# EAGLE design sx3_breakout (EAGLE 9.5.2)
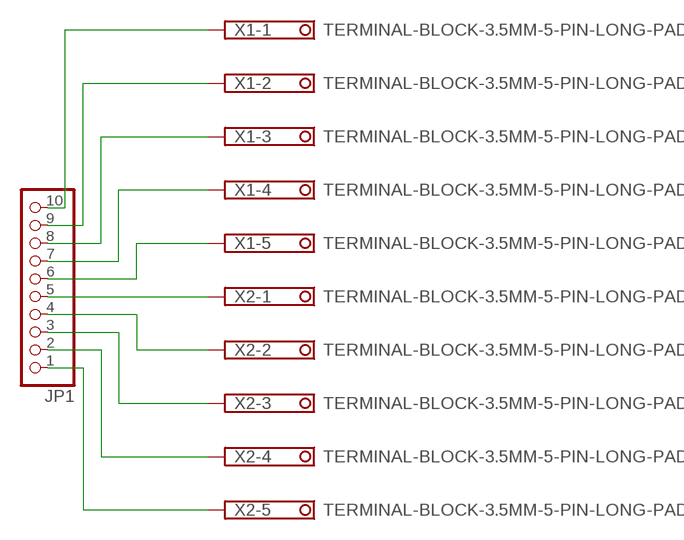
[diagram p0: schematic, sheet 1]

## Parts
JP1  PINHD-1X10  [1X10]
X1  TERMINAL-BLOCK-3.5MM-5-PIN-LONG-PAD  [TERMINAL-BLOCK-5-PIN-3.5MM-LONG-PAD]
X2  TERMINAL-BLOCK-3.5MM-5-PIN-LONG-PAD  [TERMINAL-BLOCK-5-PIN-3.5MM-LONG-PAD]

## Nets
N$1: JP1.10 X1.1
N$2: JP1.9 X1.2
N$3: JP1.8 X1.3
N$4: JP1.7 X1.4
N$5: JP1.6 X1.5
N$6: JP1.5 X2.1
N$7: JP1.4 X2.2
N$8: JP1.3 X2.3
N$9: JP1.2 X2.4
N$10: JP1.1 X2.5

## Library data of the parts
JP1 = pinhead:PINHD-1X10: PIN HEADER
X1 X2 = Rembrandt Electronics - Terminal Block 3-5mm v1-0:TERMINAL-BLOCK-3.5MM-5-PIN: Terminal Block 3.5mm Pitch: 3,5 mm Number of pins: 5 Created by Rembrandt Electronics www.rembrandtelectronics.com

## Board
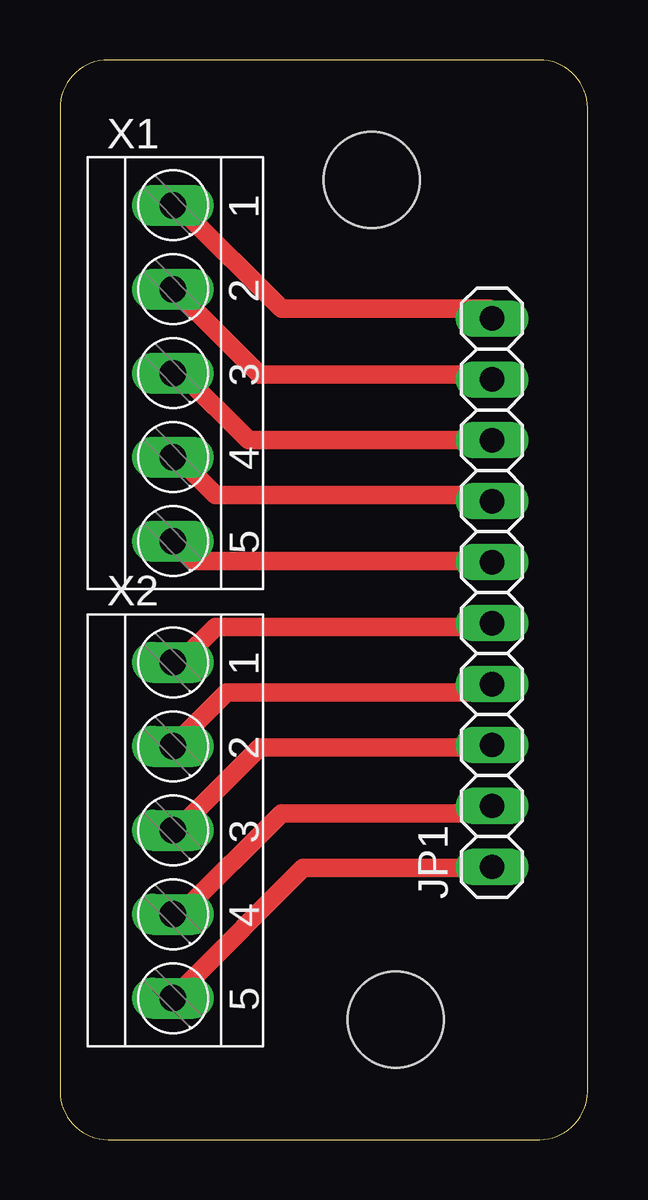
[diagram p1: board, top side]

Size 22 x 45 mm. Coordinates in mm from the lower left corner, seen from the top.
Outline: 0,43 0,2 arc90 2,0 20,0 arc90 22,2 22,43 arc90 20,45 2,45 arc90 0,43
Copper layers (1*16): Top 0.035mm / dielectric 1.5mm / Bottom 0.035mm
Design rules "default *": minimum track width 30mil, minimum drill 0.35mm, track to track 6mil, track to pad 6mil, pad to pad 6mil, via to via 6mil, smd to smd 6mil, copper to edge 40mil, drill to drill 6mil, minimum pad ring 10mil, minimum via ring 8mil, stop-mask expansion 4mil, vias tented up to drill 0mil, thermal gap 10mil
Holes 4 mm at 13,40 14,5

### Footprints (pad centres in the part's own frame; a part is rotated, then mirrored left to right if it is on the bottom)
1X10 = drill 1.016 long: 1 -11.43,0; 2 -8.89,0; 3 -6.35,0; 4 -3.81,0; 5 -1.27,0; 6 1.27,0; 7 3.81,0; 8 6.35,0; 9 8.89,0; 10 11.43,0
TERMINAL-BLOCK-5-PIN-3.5MM-LONG-PAD = drill 1.1 pad 1.7 long: 1 -7,-0.1; 2 -3.5,-0.1; 3 0,-0.1; 4 3.5,-0.1; 5 7,-0.1

### Placement (x,y rotation side)
JP1  18.02,22.8 90 top
X1  4.81,31.94 270 top
X2  4.81,12.89 270 top

### Tracks (layer width: path | path; a pad name or v marks a point on that pad's centre or on a via)
N$1
  Top 0.762: JP1.10 17.92,34.63 9.23,34.63 5.12,38.75 X1.1
N$2
  Top 0.762: JP1.9 17.92,31.89 8.31,31.89 5.12,35.09 X1.2
N$3
  Top 0.762: JP1.8 7.86,29.15 5.12,31.89 X1.3
N$4
  Top 0.762: JP1.7 17.92,26.86 6.49,26.86 5.12,28.23 X1.4
N$5
  Top 0.762: JP1.6 17.92,24.12 5.57,24.12 5.12,24.57 X1.5
N$6
  Top 0.762: JP1.5 17.92,21.37 6.49,21.37 5.12,20 X2.1
N$7
  Top 0.762: JP1.4 17.92,18.63 6.94,18.63 5.12,16.8 X2.2
N$8
  Top 0.762: JP1.3 17.92,16.34 8.31,16.34 5.12,13.14 X2.3
N$9
  Top 0.762: JP1.2 17.92,13.6 9.23,13.6 5.12,9.49 X2.4
N$10
  Top 0.762: JP1.1 17.92,11.31 10.14,11.31 5.12,6.29 X2.5